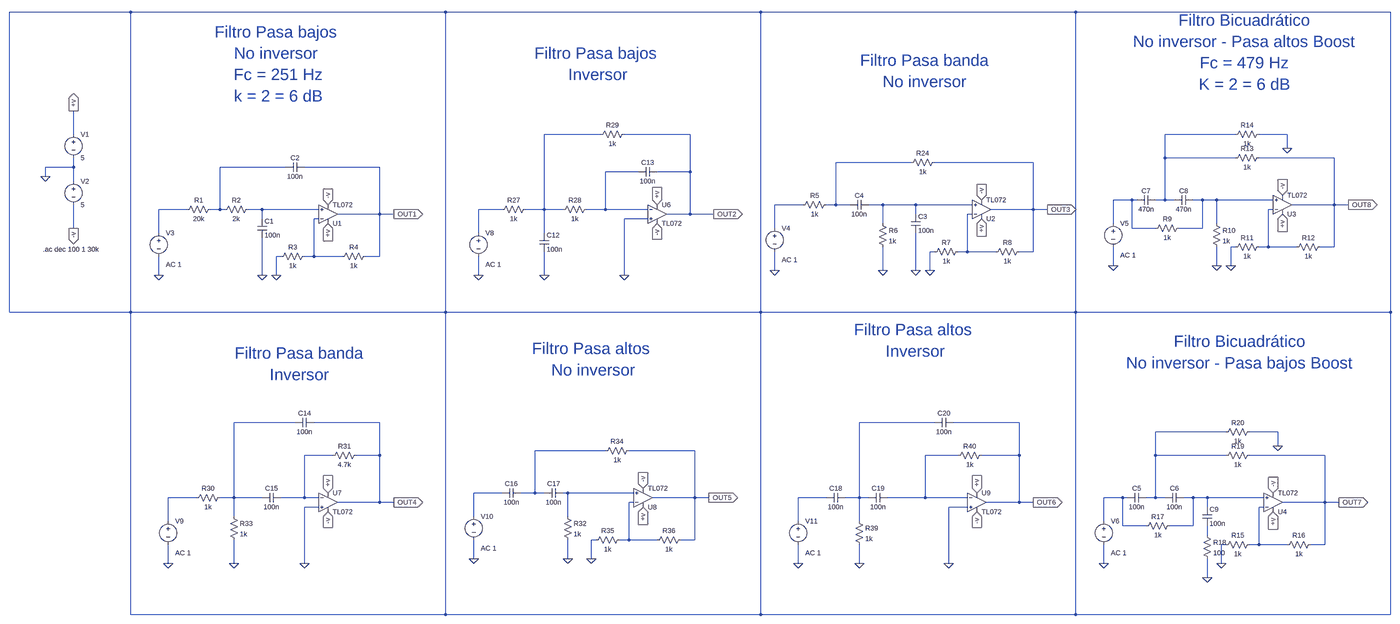
[diagram p0: schematic Audio.asc, whole sheet]
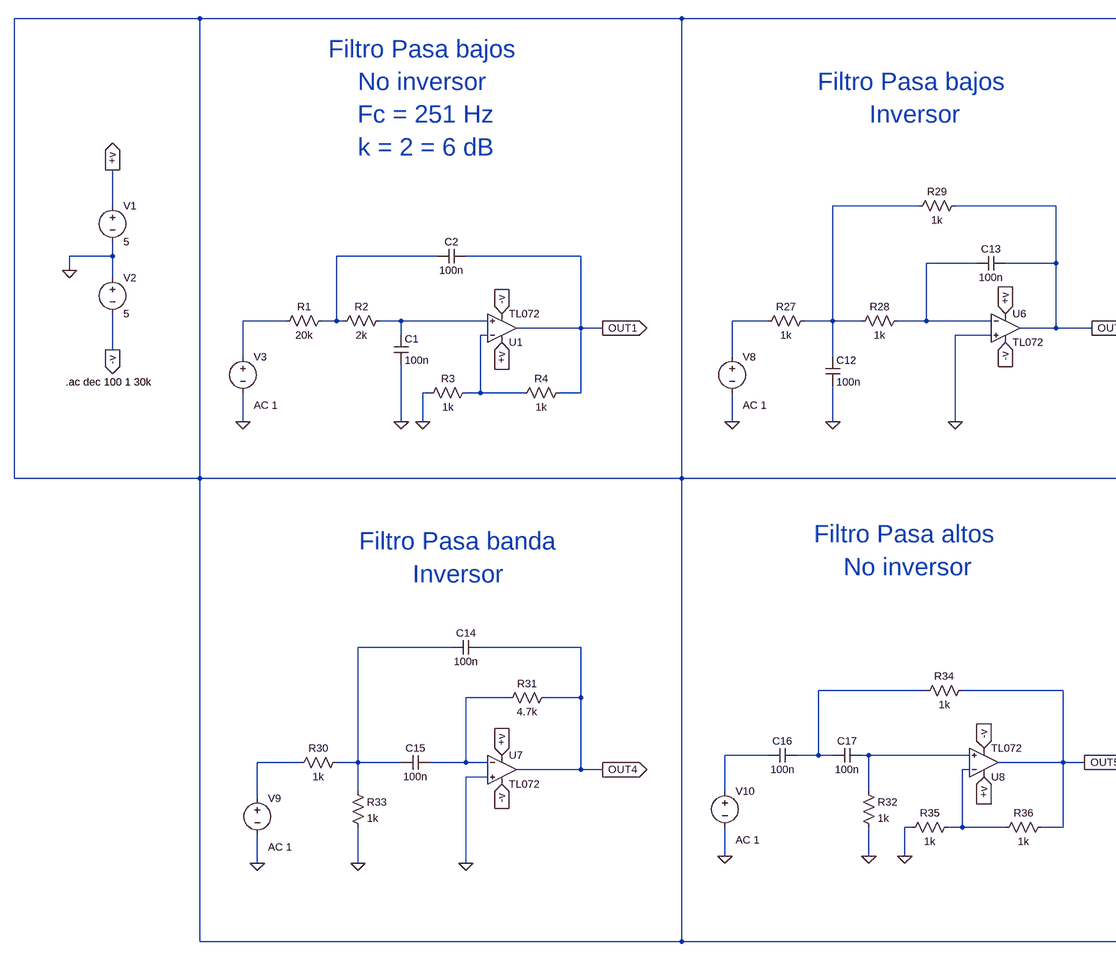
[diagram p1: schematic Audio.asc, part, row 1 of 1, column 1 of 2]
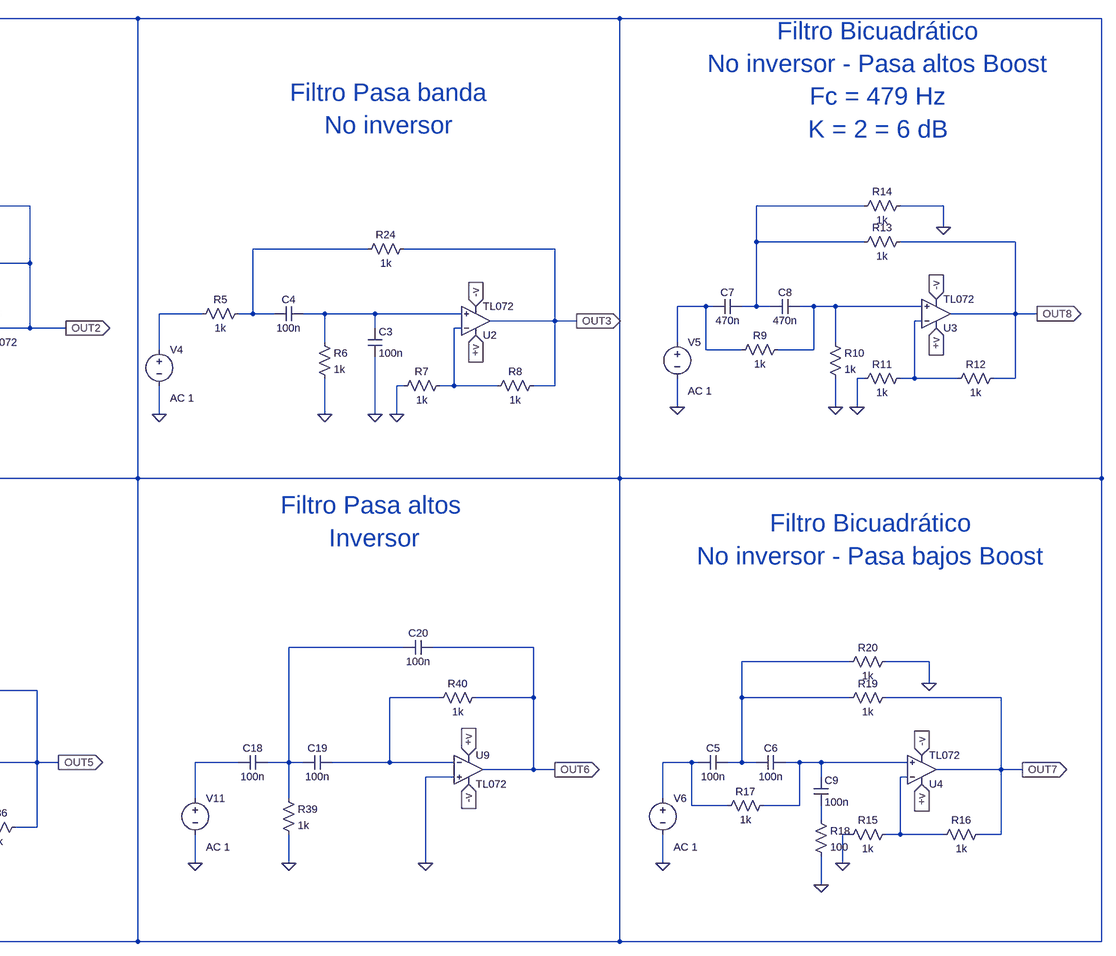
[diagram p2: schematic Audio.asc, part, row 1 of 1, column 2 of 2]
Audio.asc, the LTspice schematic file:
Version 4
SHEET 1 6924 4404
WIRE 32 -720 -432 -720
WIRE 1104 -720 32 -720
WIRE 2176 -720 1104 -720
WIRE 3248 -720 2176 -720
WIRE 4320 -720 3248 -720
WIRE -192 -304 -192 -384
WIRE 1632 -304 1440 -304
WIRE 1936 -304 1712 -304
WIRE 3792 -304 3552 -304
WIRE 3968 -304 3872 -304
WIRE 3968 -256 3968 -304
WIRE 3552 -224 3552 -304
WIRE 3792 -224 3552 -224
WIRE 4128 -224 3872 -224
WIRE 2688 -208 2432 -208
WIRE 3104 -208 2768 -208
WIRE -192 -192 -192 -224
WIRE -192 -192 -288 -192
WIRE 560 -192 336 -192
WIRE 880 -192 624 -192
WIRE 1760 -176 1648 -176
WIRE 1936 -176 1936 -304
WIRE 1936 -176 1824 -176
WIRE -288 -160 -288 -192
WIRE -192 -144 -192 -192
WIRE 3440 -80 3376 -80
WIRE 3456 -80 3440 -80
WIRE 3552 -80 3552 -224
WIRE 3552 -80 3520 -80
WIRE 3584 -80 3552 -80
WIRE 3680 -80 3648 -80
WIRE 3728 -80 3680 -80
WIRE 3920 -80 3728 -80
WIRE 2320 -64 2224 -64
WIRE 2432 -64 2432 -208
WIRE 2432 -64 2400 -64
WIRE 2480 -64 2432 -64
WIRE 2592 -64 2544 -64
WIRE 2704 -64 2592 -64
WIRE 2896 -64 2704 -64
WIRE 4128 -64 4128 -224
WIRE 4128 -64 3984 -64
WIRE 4176 -64 4128 -64
WIRE 224 -48 128 -48
WIRE 336 -48 336 -192
WIRE 336 -48 304 -48
WIRE 352 -48 336 -48
WIRE 480 -48 432 -48
WIRE 672 -48 480 -48
WIRE 1296 -48 1216 -48
WIRE 1440 -48 1440 -304
WIRE 1440 -48 1376 -48
WIRE 1504 -48 1440 -48
WIRE 1648 -48 1648 -176
WIRE 1648 -48 1584 -48
WIRE 1792 -48 1648 -48
WIRE 3104 -48 3104 -208
WIRE 3104 -48 2960 -48
WIRE 3152 -48 3104 -48
WIRE 3920 -48 3904 -48
WIRE 880 -32 880 -192
WIRE 880 -32 736 -32
WIRE 928 -32 880 -32
WIRE 1936 -32 1936 -176
WIRE 1936 -32 1856 -32
WIRE 2016 -32 1936 -32
WIRE 2704 -32 2704 -64
WIRE 2896 -32 2880 -32
WIRE 480 -16 480 -48
WIRE 672 -16 656 -16
WIRE 1792 -16 1712 -16
WIRE 2592 0 2592 -64
WIRE 3376 0 3376 -80
WIRE 3728 0 3728 -80
WIRE -192 16 -192 -64
WIRE 2224 16 2224 -64
WIRE 3440 16 3440 -80
WIRE 3520 16 3440 16
WIRE 3680 16 3680 -80
WIRE 3680 16 3600 16
WIRE 128 32 128 -48
WIRE 1216 32 1216 -48
WIRE 1440 32 1440 -48
WIRE 3792 80 3776 80
WIRE 3904 80 3904 -48
WIRE 3904 80 3872 80
WIRE 4000 80 3904 80
WIRE 4128 80 4128 -64
WIRE 4128 80 4080 80
WIRE 2768 96 2752 96
WIRE 2880 96 2880 -32
WIRE 2880 96 2848 96
WIRE 2976 96 2880 96
WIRE 3104 96 3104 -48
WIRE 3104 96 3056 96
WIRE 544 112 528 112
WIRE 656 112 656 -16
WIRE 656 112 624 112
WIRE 752 112 656 112
WIRE 880 112 880 -32
WIRE 880 112 832 112
WIRE 3376 144 3376 80
WIRE 3728 144 3728 80
WIRE 3776 144 3776 80
WIRE 2224 160 2224 96
WIRE 2592 160 2592 80
WIRE 2704 160 2704 32
WIRE 2752 160 2752 96
WIRE 128 176 128 112
WIRE 480 176 480 48
WIRE 528 176 528 112
WIRE 1216 176 1216 112
WIRE 1440 176 1440 96
WIRE 1712 176 1712 -16
WIRE -432 432 -432 -720
WIRE 32 432 32 -720
WIRE 32 432 -432 432
WIRE 1104 432 1104 -720
WIRE 1104 432 32 432
WIRE 2176 432 2176 -720
WIRE 2176 432 1104 432
WIRE 3248 432 3248 -720
WIRE 3248 432 2176 432
WIRE 4320 432 4320 -720
WIRE 4320 432 3248 432
WIRE 592 848 384 848
WIRE 880 848 656 848
WIRE 2768 848 2512 848
WIRE 3056 848 2832 848
WIRE 3760 880 3520 880
WIRE 3936 880 3840 880
WIRE 3936 928 3936 880
WIRE 1648 944 1408 944
WIRE 1952 944 1728 944
WIRE 720 960 624 960
WIRE 880 960 880 848
WIRE 880 960 800 960
WIRE 2848 960 2736 960
WIRE 3056 960 3056 848
WIRE 3056 960 2928 960
WIRE 3520 960 3520 880
WIRE 3760 960 3520 960
WIRE 4096 960 3840 960
WIRE 1296 1088 1200 1088
WIRE 1408 1088 1408 944
WIRE 1408 1088 1360 1088
WIRE 1440 1088 1408 1088
WIRE 1520 1088 1504 1088
WIRE 1744 1088 1520 1088
WIRE 256 1104 160 1104
WIRE 384 1104 384 848
WIRE 384 1104 336 1104
WIRE 480 1104 384 1104
WIRE 624 1104 624 960
WIRE 624 1104 544 1104
WIRE 672 1104 624 1104
WIRE 1952 1104 1952 944
WIRE 1952 1104 1808 1104
WIRE 2000 1104 1952 1104
WIRE 2400 1104 2304 1104
WIRE 2512 1104 2512 848
WIRE 2512 1104 2464 1104
WIRE 2544 1104 2512 1104
WIRE 2736 1104 2736 960
WIRE 2736 1104 2608 1104
WIRE 2880 1104 2736 1104
WIRE 3408 1104 3344 1104
WIRE 3424 1104 3408 1104
WIRE 3520 1104 3520 960
WIRE 3520 1104 3488 1104
WIRE 3552 1104 3520 1104
WIRE 3648 1104 3616 1104
WIRE 3696 1104 3648 1104
WIRE 3888 1104 3696 1104
WIRE 880 1120 880 960
WIRE 880 1120 736 1120
WIRE 928 1120 880 1120
WIRE 1744 1120 1728 1120
WIRE 3056 1120 3056 960
WIRE 3056 1120 2944 1120
WIRE 3104 1120 3056 1120
WIRE 4096 1120 4096 960
WIRE 4096 1120 3952 1120
WIRE 4144 1120 4096 1120
WIRE 672 1136 624 1136
WIRE 2880 1136 2816 1136
WIRE 3696 1136 3696 1104
WIRE 3888 1136 3872 1136
WIRE 384 1168 384 1104
WIRE 1200 1168 1200 1088
WIRE 1520 1168 1520 1088
WIRE 160 1184 160 1104
WIRE 2304 1184 2304 1104
WIRE 2512 1184 2512 1104
WIRE 3344 1184 3344 1104
WIRE 3408 1200 3408 1104
WIRE 3488 1200 3408 1200
WIRE 3648 1200 3648 1104
WIRE 3648 1200 3568 1200
WIRE 3696 1232 3696 1200
WIRE 1616 1248 1600 1248
WIRE 1728 1248 1728 1120
WIRE 1728 1248 1696 1248
WIRE 1824 1248 1728 1248
WIRE 1952 1248 1952 1104
WIRE 1952 1248 1904 1248
WIRE 3760 1264 3744 1264
WIRE 3872 1264 3872 1136
WIRE 3872 1264 3840 1264
WIRE 3968 1264 3872 1264
WIRE 4096 1264 4096 1120
WIRE 4096 1264 4048 1264
WIRE 1200 1312 1200 1248
WIRE 1520 1312 1520 1248
WIRE 1600 1312 1600 1248
WIRE 160 1328 160 1264
WIRE 384 1328 384 1248
WIRE 624 1328 624 1136
WIRE 2304 1328 2304 1264
WIRE 2512 1328 2512 1264
WIRE 2816 1328 2816 1136
WIRE 3344 1328 3344 1264
WIRE 3744 1328 3744 1264
WIRE 3696 1376 3696 1312
WIRE 32 1584 32 432
WIRE 1104 1584 1104 432
WIRE 1104 1584 32 1584
WIRE 2176 1584 2176 432
WIRE 2176 1584 1104 1584
WIRE 3248 1584 3248 432
WIRE 3248 1584 2176 1584
WIRE 4320 1584 4320 432
WIRE 4320 1584 3248 1584
FLAG -288 -160 0
FLAG -192 -384 +v
IOPIN -192 -384 Out
FLAG -192 16 -v
IOPIN -192 16 Out
FLAG 704 0 +v
IOPIN 704 0 In
FLAG 704 -64 -v
IOPIN 704 -64 In
FLAG 480 176 0
FLAG 528 176 0
FLAG 128 176 0
FLAG 3952 -32 +v
IOPIN 3952 -32 In
FLAG 3952 -96 -v
IOPIN 3952 -96 In
FLAG 3728 144 0
FLAG 3776 144 0
FLAG 3376 144 0
FLAG 3968 -256 0
FLAG 3920 1152 +v
IOPIN 3920 1152 In
FLAG 3920 1088 -v
IOPIN 3920 1088 In
FLAG 3696 1376 0
FLAG 3744 1328 0
FLAG 3344 1328 0
FLAG 3936 928 0
FLAG 2928 -16 +v
IOPIN 2928 -16 In
FLAG 2928 -80 -v
IOPIN 2928 -80 In
FLAG 2704 160 0
FLAG 2752 160 0
FLAG 2224 160 0
FLAG 2592 160 0
FLAG 928 -32 OUT1
IOPIN 928 -32 Out
FLAG 1824 -64 +v
IOPIN 1824 -64 In
FLAG 1824 0 -v
IOPIN 1824 0 In
FLAG 1440 176 0
FLAG 1216 176 0
FLAG 2016 -32 OUT2
IOPIN 2016 -32 Out
FLAG 1712 176 0
FLAG 3152 -48 OUT3
IOPIN 3152 -48 Out
FLAG 704 1088 +v
IOPIN 704 1088 In
FLAG 704 1152 -v
IOPIN 704 1152 In
FLAG 160 1328 0
FLAG 384 1328 0
FLAG 928 1120 OUT4
IOPIN 928 1120 Out
FLAG 624 1328 0
FLAG 1776 1136 +v
IOPIN 1776 1136 In
FLAG 1776 1072 -v
IOPIN 1776 1072 In
FLAG 1600 1312 0
FLAG 1200 1312 0
FLAG 2000 1104 OUT5
IOPIN 2000 1104 Out
FLAG 1520 1312 0
FLAG 2912 1088 +v
IOPIN 2912 1088 In
FLAG 2912 1152 -v
IOPIN 2912 1152 In
FLAG 2816 1328 0
FLAG 2304 1328 0
FLAG 3104 1120 OUT6
IOPIN 3104 1120 Out
FLAG 2512 1328 0
FLAG 4144 1120 OUT7
IOPIN 4144 1120 Out
FLAG 4176 -64 OUT8
IOPIN 4176 -64 Out
SYMBOL AutoGenerated\\TL072 704 -32 M180
SYMATTR InstName U1
SYMBOL voltage -192 -320 R0
WINDOW 123 0 0 Left 0
WINDOW 39 0 0 Left 0
SYMATTR InstName V1
SYMATTR Value 5
SYMBOL voltage -192 -160 R0
WINDOW 123 0 0 Left 0
WINDOW 39 0 0 Left 0
SYMATTR InstName V2
SYMATTR Value 5
SYMBOL res 320 -64 R90
WINDOW 0 0 56 VBottom 2
WINDOW 3 32 56 VTop 2
SYMATTR InstName R1
SYMATTR Value 20k
SYMBOL res 448 -64 R90
WINDOW 0 0 56 VBottom 2
WINDOW 3 32 56 VTop 2
SYMATTR InstName R2
SYMATTR Value 2k
SYMBOL res 640 96 R90
WINDOW 0 0 56 VBottom 2
WINDOW 3 32 56 VTop 2
SYMATTR InstName R3
SYMATTR Value 1k
SYMBOL res 848 96 R90
WINDOW 0 0 56 VBottom 2
WINDOW 3 32 56 VTop 2
SYMATTR InstName R4
SYMATTR Value 1k
SYMBOL cap 464 -16 R0
SYMATTR InstName C1
SYMATTR Value 100n
SYMBOL cap 624 -208 R90
WINDOW 0 0 32 VBottom 2
WINDOW 3 32 32 VTop 2
SYMATTR InstName C2
SYMATTR Value 100n
SYMBOL voltage 128 16 R0
WINDOW 123 24 124 Left 2
WINDOW 39 0 0 Left 0
SYMATTR Value2 AC 1
SYMATTR InstName V3
SYMATTR Value ""
SYMBOL AutoGenerated\\TL072 3952 -64 M180
SYMATTR InstName U3
SYMBOL res 3888 64 R90
WINDOW 0 0 56 VBottom 2
WINDOW 3 32 56 VTop 2
SYMATTR InstName R11
SYMATTR Value 1k
SYMBOL res 4096 64 R90
WINDOW 0 0 56 VBottom 2
WINDOW 3 32 56 VTop 2
SYMATTR InstName R12
SYMATTR Value 1k
SYMBOL voltage 3376 -16 R0
WINDOW 123 24 124 Left 2
WINDOW 39 0 0 Left 0
SYMATTR Value2 AC 1
SYMATTR InstName V5
SYMATTR Value ""
SYMBOL cap 3520 -96 R90
WINDOW 0 0 32 VBottom 2
WINDOW 3 32 32 VTop 2
SYMATTR InstName C7
SYMATTR Value 470n
SYMBOL cap 3648 -96 R90
WINDOW 0 0 32 VBottom 2
WINDOW 3 32 32 VTop 2
SYMATTR InstName C8
SYMATTR Value 470n
SYMBOL res 3616 0 R90
WINDOW 0 0 56 VBottom 2
WINDOW 3 32 56 VTop 2
SYMATTR InstName R9
SYMATTR Value 1k
SYMBOL res 3712 -16 R0
SYMATTR InstName R10
SYMATTR Value 1k
SYMBOL res 3888 -240 R90
WINDOW 0 0 56 VBottom 2
WINDOW 3 32 56 VTop 2
SYMATTR InstName R13
SYMATTR Value 1k
SYMBOL res 3888 -320 R90
WINDOW 0 0 56 VBottom 2
WINDOW 3 32 56 VTop 2
SYMATTR InstName R14
SYMATTR Value 1k
SYMBOL AutoGenerated\\TL072 3920 1120 M180
SYMATTR InstName U4
SYMBOL res 3856 1248 R90
WINDOW 0 0 56 VBottom 2
WINDOW 3 32 56 VTop 2
SYMATTR InstName R15
SYMATTR Value 1k
SYMBOL res 4064 1248 R90
WINDOW 0 0 56 VBottom 2
WINDOW 3 32 56 VTop 2
SYMATTR InstName R16
SYMATTR Value 1k
SYMBOL voltage 3344 1168 R0
WINDOW 123 24 124 Left 2
WINDOW 39 0 0 Left 0
SYMATTR Value2 AC 1
SYMATTR InstName V6
SYMATTR Value ""
SYMBOL cap 3488 1088 R90
WINDOW 0 0 32 VBottom 2
WINDOW 3 32 32 VTop 2
SYMATTR InstName C5
SYMATTR Value 100n
SYMBOL cap 3616 1088 R90
WINDOW 0 0 32 VBottom 2
WINDOW 3 32 32 VTop 2
SYMATTR InstName C6
SYMATTR Value 100n
SYMBOL res 3584 1184 R90
WINDOW 0 0 56 VBottom 2
WINDOW 3 32 56 VTop 2
SYMATTR InstName R17
SYMATTR Value 1k
SYMBOL res 3680 1216 R0
SYMATTR InstName R18
SYMATTR Value 100
SYMBOL res 3856 944 R90
WINDOW 0 0 56 VBottom 2
WINDOW 3 32 56 VTop 2
SYMATTR InstName R19
SYMATTR Value 1k
SYMBOL res 3856 864 R90
WINDOW 0 0 56 VBottom 2
WINDOW 3 32 56 VTop 2
SYMATTR InstName R20
SYMATTR Value 1k
SYMBOL cap 3680 1136 R0
SYMATTR InstName C9
SYMATTR Value 100n
SYMBOL AutoGenerated\\TL072 2928 -48 M180
SYMATTR InstName U2
SYMBOL res 2416 -80 R90
WINDOW 0 0 56 VBottom 2
WINDOW 3 32 56 VTop 2
SYMATTR InstName R5
SYMATTR Value 1k
SYMBOL res 2864 80 R90
WINDOW 0 0 56 VBottom 2
WINDOW 3 32 56 VTop 2
SYMATTR InstName R7
SYMATTR Value 1k
SYMBOL res 3072 80 R90
WINDOW 0 0 56 VBottom 2
WINDOW 3 32 56 VTop 2
SYMATTR InstName R8
SYMATTR Value 1k
SYMBOL cap 2688 -32 R0
SYMATTR InstName C3
SYMATTR Value 100n
SYMBOL voltage 2224 0 R0
WINDOW 123 24 124 Left 2
WINDOW 39 0 0 Left 0
SYMATTR Value2 AC 1
SYMATTR InstName V4
SYMATTR Value ""
SYMBOL cap 2544 -80 R90
WINDOW 0 0 32 VBottom 2
WINDOW 3 32 32 VTop 2
SYMATTR InstName C4
SYMATTR Value 100n
SYMBOL res 2576 -16 R0
SYMATTR InstName R6
SYMATTR Value 1k
SYMBOL res 2784 -224 R90
WINDOW 0 0 56 VBottom 2
WINDOW 3 32 56 VTop 2
SYMATTR InstName R24
SYMATTR Value 1k
SYMBOL AutoGenerated\\TL072 1824 -32 R0
SYMATTR InstName U6
SYMBOL res 1392 -64 R90
WINDOW 0 0 56 VBottom 2
WINDOW 3 32 56 VTop 2
SYMATTR InstName R27
SYMATTR Value 1k
SYMBOL res 1600 -64 R90
WINDOW 0 0 56 VBottom 2
WINDOW 3 32 56 VTop 2
SYMATTR InstName R28
SYMATTR Value 1k
SYMBOL cap 1424 32 R0
SYMATTR InstName C12
SYMATTR Value 100n
SYMBOL cap 1824 -192 R90
WINDOW 0 0 32 VBottom 2
WINDOW 3 32 32 VTop 2
SYMATTR InstName C13
SYMATTR Value 100n
SYMBOL voltage 1216 16 R0
WINDOW 123 24 124 Left 2
WINDOW 39 0 0 Left 0
SYMATTR Value2 AC 1
SYMATTR InstName V8
SYMATTR Value ""
SYMBOL res 1728 -320 R90
WINDOW 0 0 56 VBottom 2
WINDOW 3 32 56 VTop 2
SYMATTR InstName R29
SYMATTR Value 1k
SYMBOL AutoGenerated\\TL072 704 1120 R0
SYMATTR InstName U7
SYMBOL res 352 1088 R90
WINDOW 0 0 56 VBottom 2
WINDOW 3 32 56 VTop 2
SYMATTR InstName R30
SYMATTR Value 1k
SYMBOL voltage 160 1168 R0
WINDOW 123 24 124 Left 2
WINDOW 39 0 0 Left 0
SYMATTR Value2 AC 1
SYMATTR InstName V9
SYMATTR Value ""
SYMBOL res 368 1152 R0
SYMATTR InstName R33
SYMATTR Value 1k
SYMBOL cap 544 1088 R90
WINDOW 0 0 32 VBottom 2
WINDOW 3 32 32 VTop 2
SYMATTR InstName C15
SYMATTR Value 100n
SYMBOL res 816 944 R90
WINDOW 0 0 56 VBottom 2
WINDOW 3 32 56 VTop 2
SYMATTR InstName R31
SYMATTR Value 4.7k
SYMBOL cap 656 832 R90
WINDOW 0 0 32 VBottom 2
WINDOW 3 32 32 VTop 2
SYMATTR InstName C14
SYMATTR Value 100n
SYMBOL AutoGenerated\\TL072 1776 1104 M180
SYMATTR InstName U8
SYMBOL res 1712 1232 R90
WINDOW 0 0 56 VBottom 2
WINDOW 3 32 56 VTop 2
SYMATTR InstName R35
SYMATTR Value 1k
SYMBOL res 1920 1232 R90
WINDOW 0 0 56 VBottom 2
WINDOW 3 32 56 VTop 2
SYMATTR InstName R36
SYMATTR Value 1k
SYMBOL voltage 1200 1152 R0
WINDOW 123 24 124 Left 2
WINDOW 39 0 0 Left 0
SYMATTR Value2 AC 1
SYMATTR InstName V10
SYMATTR Value ""
SYMBOL cap 1360 1072 R90
WINDOW 0 0 32 VBottom 2
WINDOW 3 32 32 VTop 2
SYMATTR InstName C16
SYMATTR Value 100n
SYMBOL cap 1504 1072 R90
WINDOW 0 0 32 VBottom 2
WINDOW 3 32 32 VTop 2
SYMATTR InstName C17
SYMATTR Value 100n
SYMBOL res 1504 1152 R0
SYMATTR InstName R32
SYMATTR Value 1k
SYMBOL res 1744 928 R90
WINDOW 0 0 56 VBottom 2
WINDOW 3 32 56 VTop 2
SYMATTR InstName R34
SYMATTR Value 1k
SYMBOL AutoGenerated\\TL072 2912 1120 R0
SYMATTR InstName U9
SYMBOL voltage 2304 1168 R0
WINDOW 123 24 124 Left 2
WINDOW 39 0 0 Left 0
SYMATTR Value2 AC 1
SYMATTR InstName V11
SYMATTR Value ""
SYMBOL cap 2464 1088 R90
WINDOW 0 0 32 VBottom 2
WINDOW 3 32 32 VTop 2
SYMATTR InstName C18
SYMATTR Value 100n
SYMBOL cap 2608 1088 R90
WINDOW 0 0 32 VBottom 2
WINDOW 3 32 32 VTop 2
SYMATTR InstName C19
SYMATTR Value 100n
SYMBOL res 2496 1168 R0
SYMATTR InstName R39
SYMATTR Value 1k
SYMBOL res 2944 944 R90
WINDOW 0 0 56 VBottom 2
WINDOW 3 32 56 VTop 2
SYMATTR InstName R40
SYMATTR Value 1k
SYMBOL cap 2832 832 R90
WINDOW 0 0 32 VBottom 2
WINDOW 3 32 32 VTop 2
SYMATTR InstName C20
SYMATTR Value 100n
TEXT -296 88 Left 2 !.ac dec 100 1 30k
TEXT 3824 -584 Center 5 ;Filtro Bicuadrático\nNo inversor - Pasa altos Boost\nFc = 479 Hz\nK = 2 = 6 dB
TEXT 3808 568 Center 5 ;Filtro Bicuadrático\nNo inversor - Pasa bajos Boost
TEXT 536 -544 Center 5 ;Filtro Pasa bajos \nNo inversor \nFc = 251 Hz\nk = 2 = 6 dB
TEXT 1624 -544 Center 5 ;Filtro Pasa bajos \nInversor
TEXT 2736 -520 Center 5 ;Filtro Pasa banda\nNo inversor
TEXT 608 608 Center 5 ;Filtro Pasa banda\nInversor
TEXT 1608 592 Center 5 ;Filtro Pasa altos \nNo inversor
TEXT 2704 528 Center 5 ;Filtro Pasa altos \nInversor

The netlist it stands for:
* Audio.asc
* U1: TL072 (symbol AutoGenerated\TL072 not available, pins judged from their places): In+=N012 In-=N016 V+=+v V-=-v OUT=OUT1
V1 +v 0 5
V2 0 -v 5
R1 N005 N011 20k
R2 N012 N005 2k
R3 N016 0 1k
R4 OUT1 N016 1k
C1 N012 0 100n
C2 OUT1 N005 100n
V3 N011 0 AC 1
* U3: TL072 (symbol AutoGenerated\TL072 not available, pins judged from their places): In+=N008 In-=N014 V+=+v V-=-v OUT=OUT8
R11 N014 0 1k
R12 OUT8 N014 1k
V5 N007 0 AC 1
C7 N003 N007 470n
C8 N008 N003 470n
R9 N008 N007 1k
R10 N008 0 1k
R13 OUT8 N003 1k
R14 0 N003 1k
* U4: TL072 (symbol AutoGenerated\TL072 not available, pins judged from their places): In+=N028 In-=N030 V+=+v V-=-v OUT=OUT7
R15 N030 0 1k
R16 OUT7 N030 1k
V6 N027 0 AC 1
C5 N019 N027 100n
C6 N028 N019 100n
R17 N028 N027 1k
R18 N031 0 100
R19 OUT7 N019 1k
R20 0 N019 1k
C9 N028 N031 100n
* U2: TL072 (symbol AutoGenerated\TL072 not available, pins judged from their places): In+=N010 In-=N015 V+=+v V-=-v OUT=OUT3
R5 N004 N009 1k
R7 N015 0 1k
R8 OUT3 N015 1k
C3 N010 0 100n
V4 N009 0 AC 1
C4 N010 N004 100n
R6 N010 0 1k
R24 OUT3 N004 1k
* U6: TL072 (symbol AutoGenerated\TL072 not available, pins judged from their places): In+=0 In-=N006 V+=+v V-=-v OUT=OUT2
R27 N002 N013 1k
R28 N006 N002 1k
C12 N002 0 100n
C13 OUT2 N006 100n
V8 N013 0 AC 1
R29 OUT2 N002 1k
* U7: TL072 (symbol AutoGenerated\TL072 not available, pins judged from their places): In+=0 In-=N021 V+=+v V-=-v OUT=OUT4
R30 N017 N025 1k
V9 N025 0 AC 1
R33 N017 0 1k
C15 N021 N017 100n
R31 OUT4 N021 4.7k
C14 OUT4 N017 100n
* U8: TL072 (symbol AutoGenerated\TL072 not available, pins judged from their places): In+=N024 In-=N029 V+=+v V-=-v OUT=OUT5
R35 N029 0 1k
R36 OUT5 N029 1k
V10 N023 0 AC 1
C16 N020 N023 100n
C17 N024 N020 100n
R32 N024 0 1k
R34 OUT5 N020 1k
* U9: TL072 (symbol AutoGenerated\TL072 not available, pins judged from their places): In+=0 In-=N022 V+=+v V-=-v OUT=OUT6
V11 N026 0 AC 1
C18 N018 N026 100n
C19 N022 N018 100n
R39 N018 0 1k
R40 OUT6 N022 1k
C20 OUT6 N018 100n
.ac dec 100 1 30k
* Filtro Bicuadrático
* No inversor - Pasa altos Boost
* Fc = 479 Hz
* K = 2 = 6 dB
* Filtro Bicuadrático
* No inversor - Pasa bajos Boost
* Filtro Pasa bajos
* No inversor
* Fc = 251 Hz
* k = 2 = 6 dB
* Filtro Pasa bajos
* Inversor
* Filtro Pasa banda
* No inversor
* Filtro Pasa banda
* Inversor
* Filtro Pasa altos
* No inversor
* Filtro Pasa altos
* Inversor
.backanno
.end